# Altium project MSP430_GPRS V1.0.PrjPCB
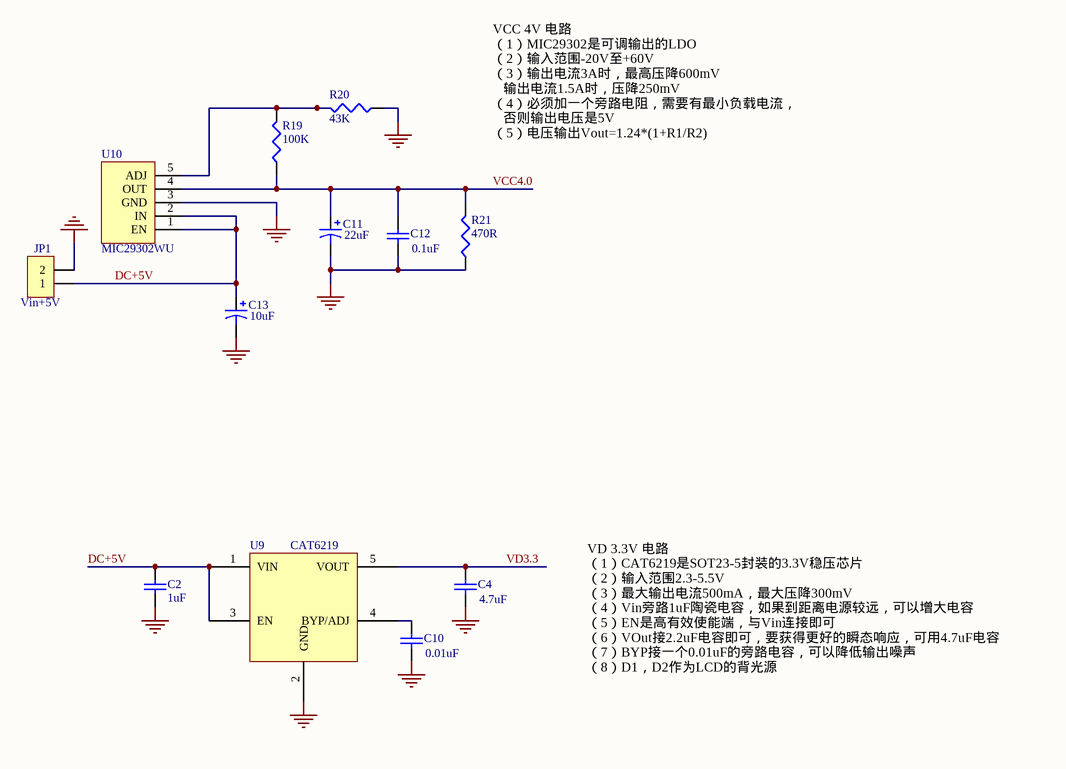
[diagram p0: Power.SchDoc]
2 sheets, 13 parts. Net scope: global (net labels, ports and power ports of the same name join across sheets).
Board file: MSP430_GPRS_1.PcbDoc
Sheets:
  Power.SchDoc
  MSP430MCU.SchDoc

## Sheet Power.SchDoc: 电源电路
size A4

### Parts
C2  value 1uF  [1608[0603]]  (hidden comment: Cap Semi)
C4  value 4.7uF  [1608[0603]]  (hidden comment: Cap Semi)
C10  value 0.01uF  [1608[0603]]  (hidden comment: Cap Semi)
C11  value 22uF  [C0805]  (hidden comment: Cap Pol3)
C12  value 0.1uF  [1608[0603]]  (hidden comment: Cap Semi)
C13  value 10uF  [C0805]  (hidden comment: Cap Pol3)
JP1  Vin+5V  [XH2.54-2P]
R19  value 100K  [J1-0603]  (hidden comment: Res3)
R20  value 43K  [J1-0603]  (hidden comment: Res3)
R21  value 470R  [J1-0603]  (hidden comment: Res3)
U9  CAT6219  [SOT23-5]
U10  MIC29302WU  [TO263-5]

### Nets
GND: C2.2 C4.1 C10.1 C11.2 C12.1 C13.2 JP1.2 R20.1 R21.1 U9.2(GND) U10.3(GND)
DC+5V: C2.1 C13.1 JP1.1 U9.1(VIN) U9.3(EN) U10.1(EN) U10.2(IN)
VCC4.0: C11.1 C12.2 R19.1 R21.2 U10.4(OUT)
VD3.3: C4.2 U9.5(VOUT)
NetC10_2: C10.2 U9.4(BYP/ADJ)
NetR19_2: R19.2 R20.2 U10.5(ADJ)

### Notes on the sheet
- VCC 4V 电路
  （1）MIC29302是可调输出的LDO
  （2）输入范围-20V至+60V
  （3）输出电流3A时，最高压降600mV
  输出电流1.5A时，压降250mV
  （4）必须加一个旁路电阻，需要有最小负载电流，
  否则输出电压是5V
  （5）电压输出Vout=1.24*(1+R1/R2)
- VD 3.3V 电路
  （1）CAT6219是SOT23-5封装的3.3V稳压芯片
  （2）输入范围2.3-5.5V
  （3）最大输出电流500mA，最大压降300mV
  （4）Vin旁路1uF陶瓷电容，如果到距离电源较远，可以增大电容
  （5）EN是高有效使能端，与Vin连接即可
  （6）VOut接2.2uF电容即可，要获得更好的瞬态响应，可用4.7uF电容
  （7）BYP接一个0.01uF的旁路电容，可以降低输出噪声
  （8）D1，D2作为LCD的背光源

### Library data of the parts
C2 C4 C10 C12 = Cap Semi: Capacitor (Semiconductor SIM Model); Published: 8-Jun-2000; LatestRevisionDate: 29-May-2009; LatestRevisionNote: IPC-7351 Footprint Added.; PackageReference: C1206; Publisher: Altium Limited; PackageDescription: Chip Capacitor
C11 C13 = Cap Pol3: Polarized Capacitor (Surface Mount); Published: 8-Jun-2000; LatestRevisionDate: 29-May-2009; LatestRevisionNote: IPC-7351 Footprint Added.; PackageReference: C0805; Publisher: Altium Limited; PackageDescription: Chip Capacitor
JP1 = Header 2: 2P接插件; 版权归属: 源创客; BOM名称: 2P接插件; 学习资源: www.ooocke.com
R19-R21 = Res3: Resistor; Published: 8-Jun-2000; LatestRevisionDate: 29-May-2009; LatestRevisionNote: IPC-7351 Footprint Added.; PackageReference: J1-0603; Publisher: Altium Limited; PackageDescription: Chip Resistor
U9 = CAT6219: 500 mA CMOS LDO Regulator
U10 = MIC29302WU: 2A,  adjustable LDO

## Sheet MSP430MCU.SchDoc: MSP430MCU 电路
size A4
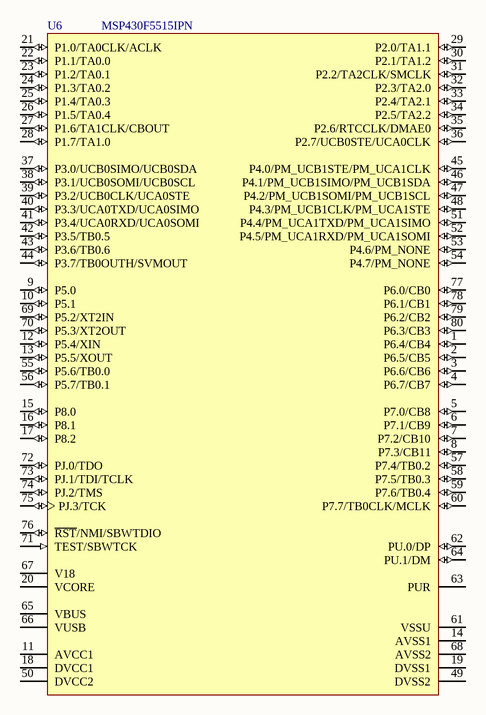
[diagram p1: MSP430MCU.SchDoc]

### Parts
U6  MSP430F5515IPN  [LQFP80 12x12_M]

### Nets

Not connected (* = marked no-connect by the designer): U6 1(P6.4/CB4) 2(P6.5/CB5) 3(P6.6/CB6) 4(P6.7/CB7) 5(P7.0/CB8) 6(P7.1/CB9) 7(P7.2/CB10) 8(P7.3/CB11) 9(P5.0) 10(P5.1) 11(AVCC1) 12(P5.4/XIN) 13(P5.5/XOUT) 14(AVSS1) 15(P8.0) 16(P8.1) 17(P8.2) 18(DVCC1) 19(DVSS1) 20(VCORE) 21(P1.0/TA0CLK/ACLK) 22(P1.1/TA0.0) 23(P1.2/TA0.1) 24(P1.3/TA0.2) 25(P1.4/TA0.3) 26(P1.5/TA0.4) 27(P1.6/TA1CLK/CBOUT) 28(P1.7/TA1.0) 29(P2.0/TA1.1) 30(P2.1/TA1.2) 31(P2.2/TA2CLK/SMCLK) 32(P2.3/TA2.0) 33(P2.4/TA2.1) 34(P2.5/TA2.2) 35(P2.6/RTCCLK/DMAE0) 36(P2.7/UCB0STE/UCA0CLK) 37(P3.0/UCB0SIMO/UCB0SDA) 38(P3.1/UCB0SOMI/UCB0SCL) 39(P3.2/UCB0CLK/UCA0STE) 40(P3.3/UCA0TXD/UCA0SIMO) 41(P3.4/UCA0RXD/UCA0SOMI) 42(P3.5/TB0.5) 43(P3.6/TB0.6) 44(P3.7/TB0OUTH/SVMOUT) 45(P4.0/PM_UCB1STE/PM_UCA1CLK) 46(P4.1/PM_UCB1SIMO/PM_UCB1SDA) 47(P4.2/PM_UCB1SOMI/PM_UCB1SCL) 48(P4.3/PM_UCB1CLK/PM_UCA1STE) 49(DVSS2) 50(DVCC2) 51(P4.4/PM_UCA1TXD/PM_UCA1SIMO) 52(P4.5/PM_UCA1RXD/PM_UCA1SOMI) 53(P4.6/PM_NONE) 54(P4.7/PM_NONE) 55(P5.6/TB0.0) 56(P5.7/TB0.1) 57(P7.4/TB0.2) 58(P7.5/TB0.3) 59(P7.6/TB0.4) 60(P7.7/TB0CLK/MCLK) 61(VSSU) 62(PU.0/DP) 63(PUR) 64(PU.1/DM) 65(VBUS) 66(VUSB) 67(V18) 68(AVSS2) 69(P5.2/XT2IN) 70(P5.3/XT2OUT) 71(TEST/SBWTCK) 72(PJ.0/TDO) 73(PJ.1/TDI/TCLK) 74(PJ.2/TMS) 75(PJ.3/TCK) 76(~{RST}/NMI/SBWTDIO) 77(P6.0/CB0) 78(P6.1/CB1) 79(P6.2/CB2) 80(P6.3/CB3)

### Library data of the parts
U6 = MSP430F5515IPN: 25 MHz Mixed Signal Microcontroller with 64 KB Flash, 4096 B SRAM and 63 GPIOs, -40 to 85 degC, 80-pin QFP (PN), Green (RoHS & no Sb/Br); Manufacturer: Texas Instruments; Brown Out Reset: Yes; DMA: 3; Flash(KB): 64; Frequency(MHz): 25; GPIO: 63; Multiplier: 32x32; SRAM(B): 4096; SubFamily: 5 Series; Timers - 16-bit: 4; USB: 1; USCI_A (UART/LIN/IrDA/SPI): 2